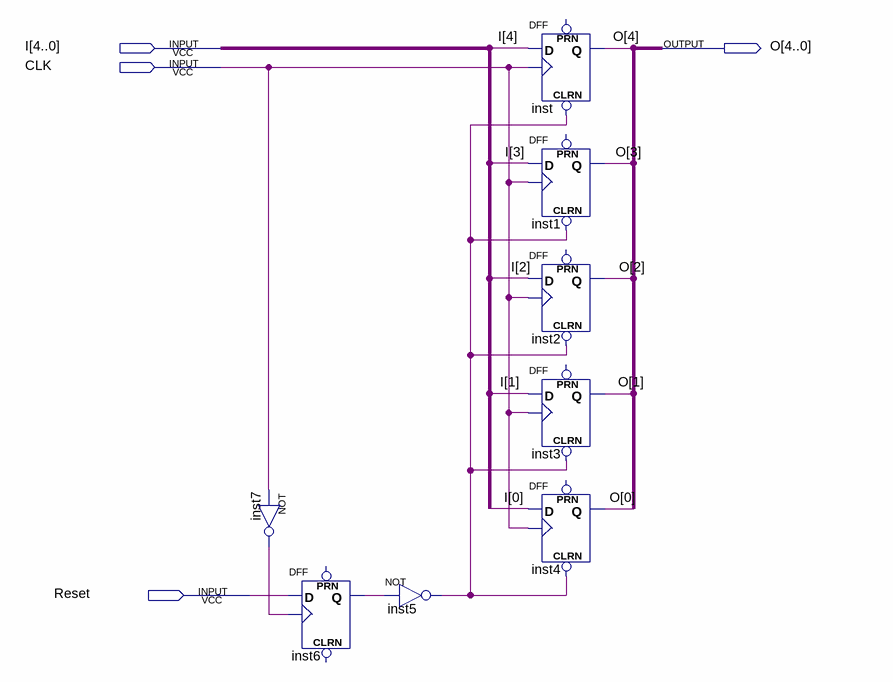
[diagram p0: schematic sheet]
// Quartus schematic register5_clr.bdf as structural Verilog: 8 symbols, 4 pins
module register5_clr (
  input  [4:0] I,
  input  CLK,
  input  Reset,
  output [4:0] O
);

  wire inst5_out, inst6_q, inst7_out;

  not inst7 (inst7_out, CLK);
  DFF inst6 (.CLK(inst7_out), .D(Reset), .Q(inst6_q));  // open: CLRN, PRN
  not inst5 (inst5_out, inst6_q);
  DFF inst (.CLRN(inst5_out), .CLK(CLK), .D(I[4]), .Q(O[4]));  // open: PRN
  DFF inst1 (.CLRN(inst5_out), .CLK(CLK), .D(I[3]), .Q(O[3]));  // open: PRN
  DFF inst2 (.CLRN(inst5_out), .CLK(CLK), .D(I[2]), .Q(O[2]));  // open: PRN
  DFF inst3 (.CLRN(inst5_out), .CLK(CLK), .D(I[1]), .Q(O[1]));  // open: PRN
  DFF inst4 (.CLRN(inst5_out), .CLK(CLK), .D(I[0]), .Q(O[0]));  // open: PRN
endmodule
